# EAGLE design TimerShield (EAGLE 6.3)
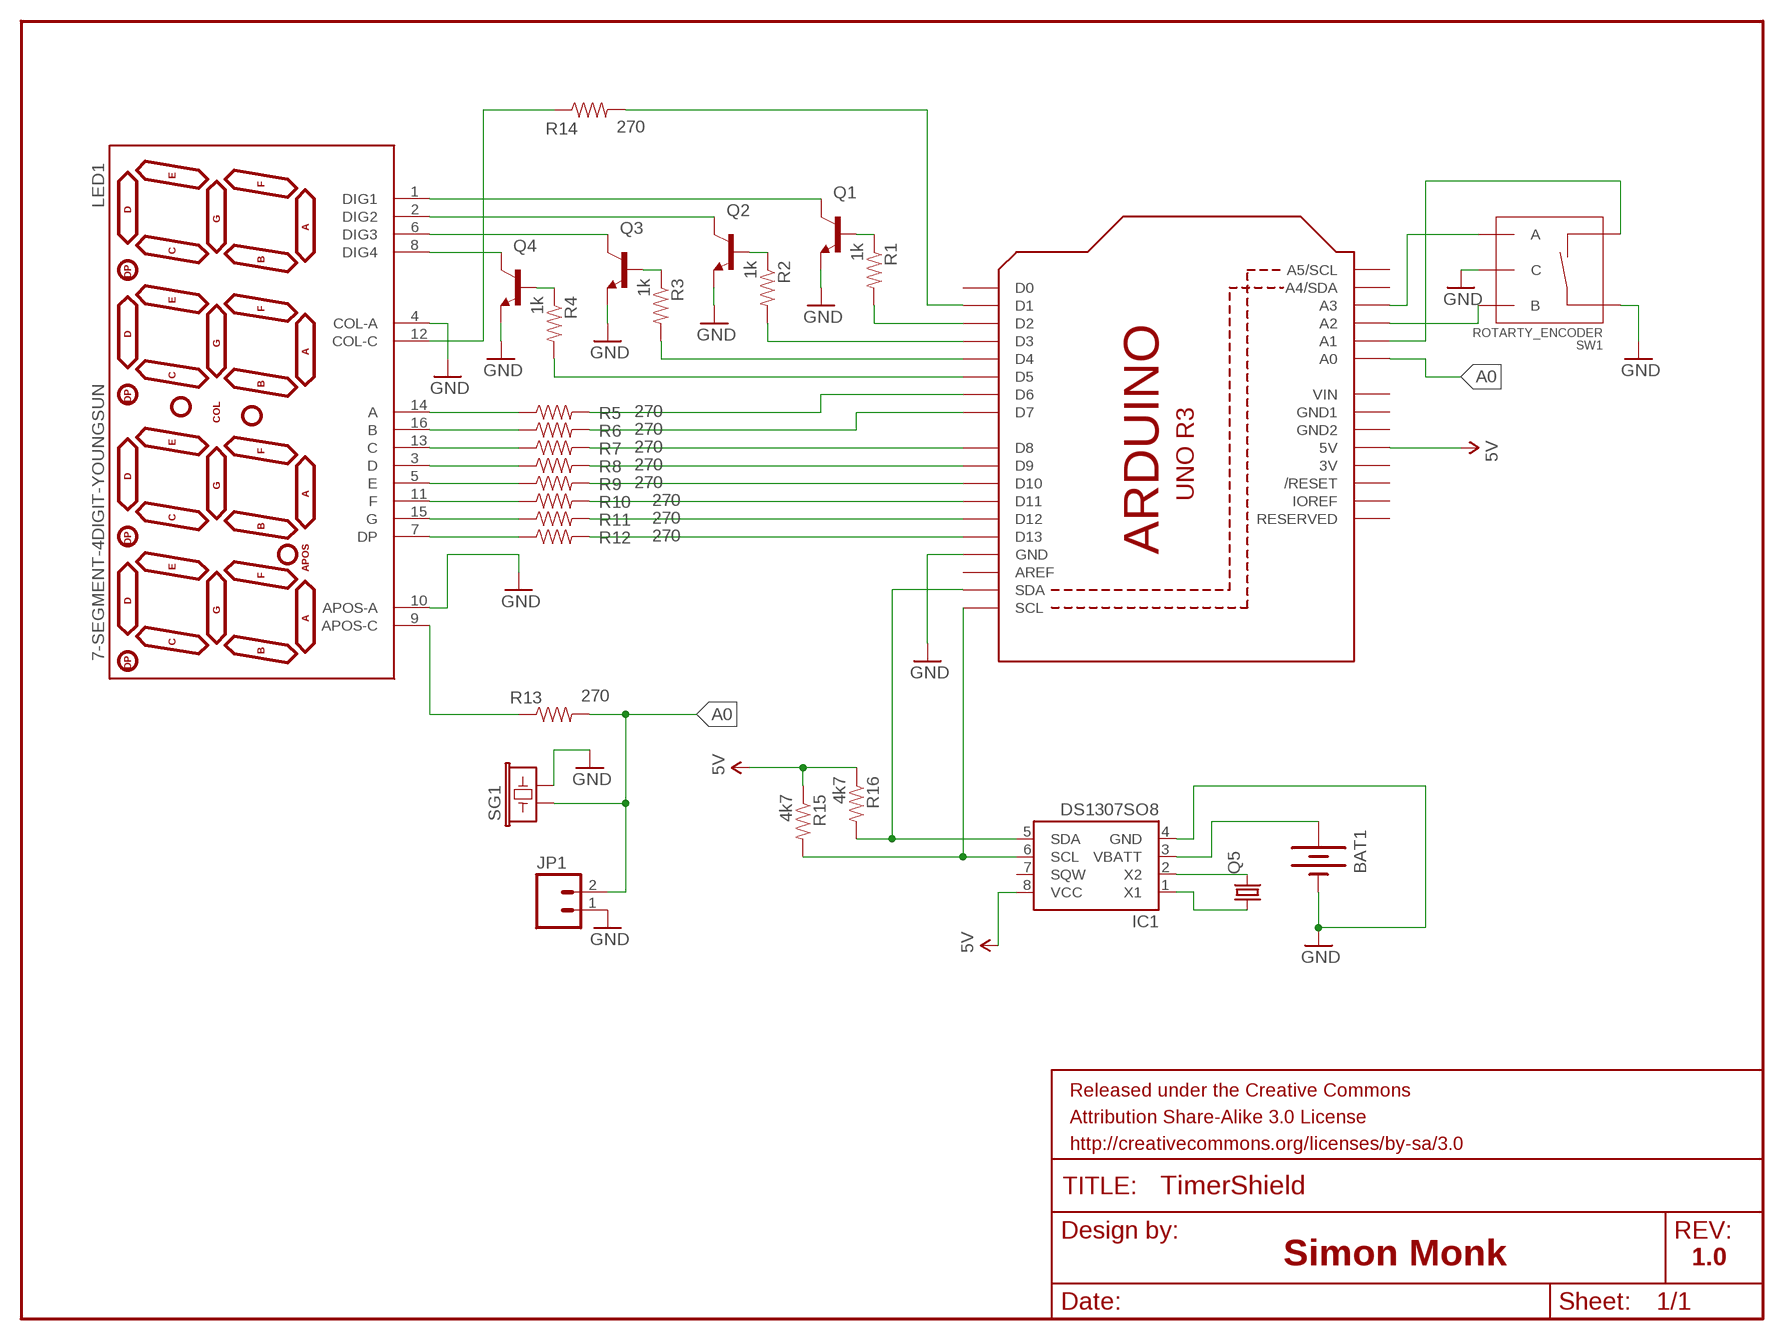
[diagram p0: schematic, sheet 1]

## Parts
BAT1  BATTERY12MM  [BATTCON_12MM]
FRAME1  FRAME-LETTER  [CREATIVE_COMMONS]
IC1  DS1307SO8  [SO08]
JP1  M023.5MM  [SCREWTERMINAL-3.5MM-2]
LED1  7-SEGMENT-4DIGIT-YOUNGSUN  [7-SEGMENT-4DIGIT-YOUNGSUN]
Q1  TRANSISTOR_NPNSOT23  [SOT23]
Q2  TRANSISTOR_NPNSOT23  [SOT23]
Q3  TRANSISTOR_NPNSOT23  [SOT23]
Q4  TRANSISTOR_NPNSOT23  [SOT23]
Q5  CRYSTALTC26H  [TC26H]
R1  1k  RESISTOR0805-RES  [0805]
R2  1k  RESISTOR0805-RES  [0805]
R3  1k  RESISTOR0805-RES  [0805]
R4  1k  RESISTOR0805-RES  [0805]
R5  270  RESISTOR0805-RES  [0805]
R6  270  RESISTOR0805-RES  [0805]
R7  270  RESISTOR0805-RES  [0805]
R8  270  RESISTOR0805-RES  [0805]
R9  270  RESISTOR0805-RES  [0805]
R10  270  RESISTOR0805-RES  [0805]
R11  270  RESISTOR0805-RES  [0805]
R12  270  RESISTOR0805-RES  [0805]
R13  270  RESISTOR0805-RES  [0805]
R14  270  RESISTOR0805-RES  [0805]
R15  4k7  RESISTOR0805-RES  [0805]
R16  4k7  RESISTOR0805-RES  [0805]
SG1  BUZZERNS  [BUZZER-12MM-NS]
SW1  ROTARTY_ENCODER  [ROTARY_ENC_PLAIN]
U1  ARDUINOR3-DIMENSION  [ARDUINOR3]

## Nets
5V: IC1.8(VCC) R15.1 R16.1 U1.5V
A0: JP1.2 R13.2 SG1.+ U1.A0
GND [power]: BAT1.GND(-) IC1.4(GND) JP1.1 LED1.4(COL-A) LED1.10(APOS-A) Q1.2(E) Q2.2(E) Q3.2(E) Q4.2(E) SG1.- SW1.C SW1.SW+ U1.GND
N$1 [power]: LED1.8(DIG4) Q4.3(C)
N$2 [power]: LED1.6(DIG3) Q3.3(C)
N$3 [power]: LED1.2(DIG2) Q2.3(C)
N$4 [power]: LED1.1(DIG1) Q1.3(C)
N$5: Q4.1(B) R4.1
N$6: Q3.1(B) R3.1
N$7: Q2.1(B) R2.1
N$8: Q1.1(B) R1.1
N$9: R1.2 U1.D2
N$10: R2.2 U1.D3
N$11: R3.2 U1.D4
N$12: R4.2 U1.D5
N$13: LED1.14(A) R5.1
N$14: LED1.16(B) R6.1
N$15: LED1.13(C) R7.1
N$16: LED1.3(D) R8.1
N$17: LED1.5(E) R9.1
N$18: LED1.11(F) R10.1
N$19: LED1.15(G) R11.1
N$20: LED1.7(DP) R12.1
N$21: R5.2 U1.D6
N$22: R6.2 U1.D7
N$23: R7.2 U1.D8
N$24: R8.2 U1.D9
N$25: R9.2 U1.D10
N$26: R10.2 U1.D11
N$27: R11.2 U1.D12
N$28: R12.2 U1.D13
N$29: LED1.12(COL-C) R14.1
N$31: SW1.A U1.A3
N$32: SW1.B U1.A2
N$33: R14.2 U1.D1
N$34: SW1.SW- U1.A1
N$35: IC1.2(X2) Q5.2
N$36: IC1.1(X1) Q5.1
N$37: IC1.6(SCL) R15.2 U1.SCL
N$38: IC1.5(SDA) R16.2 U1.SDA
N$39: LED1.9(APOS-C) R13.1
N$40: BAT1.PWR@1(+) IC1.3(VBATT)
Unconnected: IC1.7(SQW) U1.A4(A4/SDA) U1.A5(A5/SCL) U1.AREF U1.D0 U1.IOREF U1.RESERVED U1.RESET(/RESET)

## Notes on the sheet
- Simon Monk | 1.0

## Power pins joined to a net without a drawn wire
3V: U1.3V
GND1: U1.GND1
GND2: U1.GND2
VIN: U1.VIN

## Library data of the parts
BAT1 = SparkFun-Electromechanical:BATTERY: Battery Holders Various common sizes : AA, AAA, 20mm coin cell and 12mm coin cell. 20MM_4LEGS, BATT-10373
FRAME1 = SparkFun-Aesthetics:FRAME-LETTER: Schematic Frame Standard 8.5x11 US Letter frame
IC1 = SparkFun-FreqCtrl:DS1307: I2C real-time clock with battery backup.
JP1 = SparkFun-Connectors:M02: Header 2 Standard 2-pin 0.1" header. Use with straight break away headers (SKU : PRT-00116), right angle break away headers (PRT-00553), swiss pins (PRT-00743), machine pins (PRT-00117), and female headers (PRT-00115). Molex polarized connector foot print use with SKU : PRT-08233 with associated crimp pins and housings.
LED1 = SparkFun-Displays:7-SEGMENT-4DIGIT-YOUNGSUN: This is a part for the 4-Digit 7-segment LEDs from Young Sun. Different from the Digikey LEDs, all 16 pins are used. The LONGPADS Variant is used for a test jig, but you may like it because there is more pad to solder to. If you are concerned about routing space, the standard works just fine though.
Q1-Q4 = SparkFun-DiscreteSemi:TRANSISTOR_NPN: Generic NPN BJT. MMBT2222 is the common NPN we use. Double check against datasheet- not all devices are the same!
Q5 = adafruit:CRYSTAL: CRYSTAL; OC_FARNELL: unknown; OC_NEWARK: unknown
R1-R16 = SparkFun-Resistors:RESISTOR: Resistor Basic schematic elements and footprints for 0603, 1206, and PTH resistors.
SG1 = SparkFun-Electromechanical:BUZZER: Buzzer 12mm Spark Fun Electronics SKU : Comp-Buzzer
SW1 = SparkFun-Electromechanical:ROTARTY_ENCODER: Simple no LED rotary encoder Example: COM-09117
U1 = adafruit:ARDUINOR3: This is a new object for the new Arduino R3 - with extra pins that you may want to use (such as IOref, and duplicated A4/A5

## Net classes
0 default: width 0.305 mm
1 power: width 0.61 mm

## Board
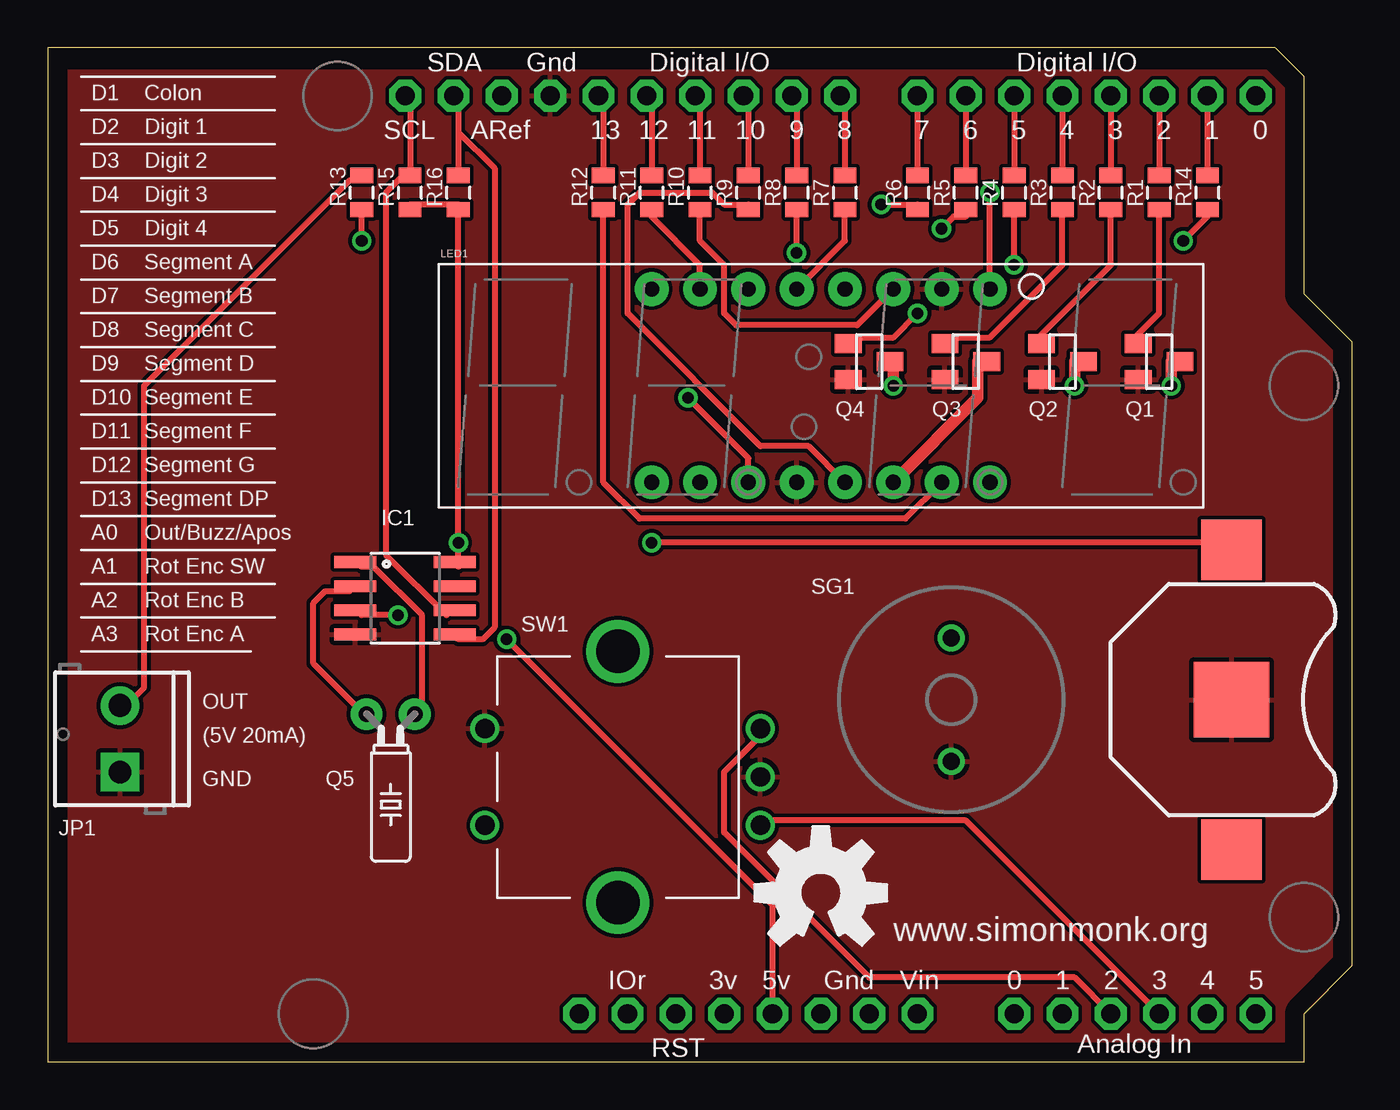
[diagram p1: board, top side]
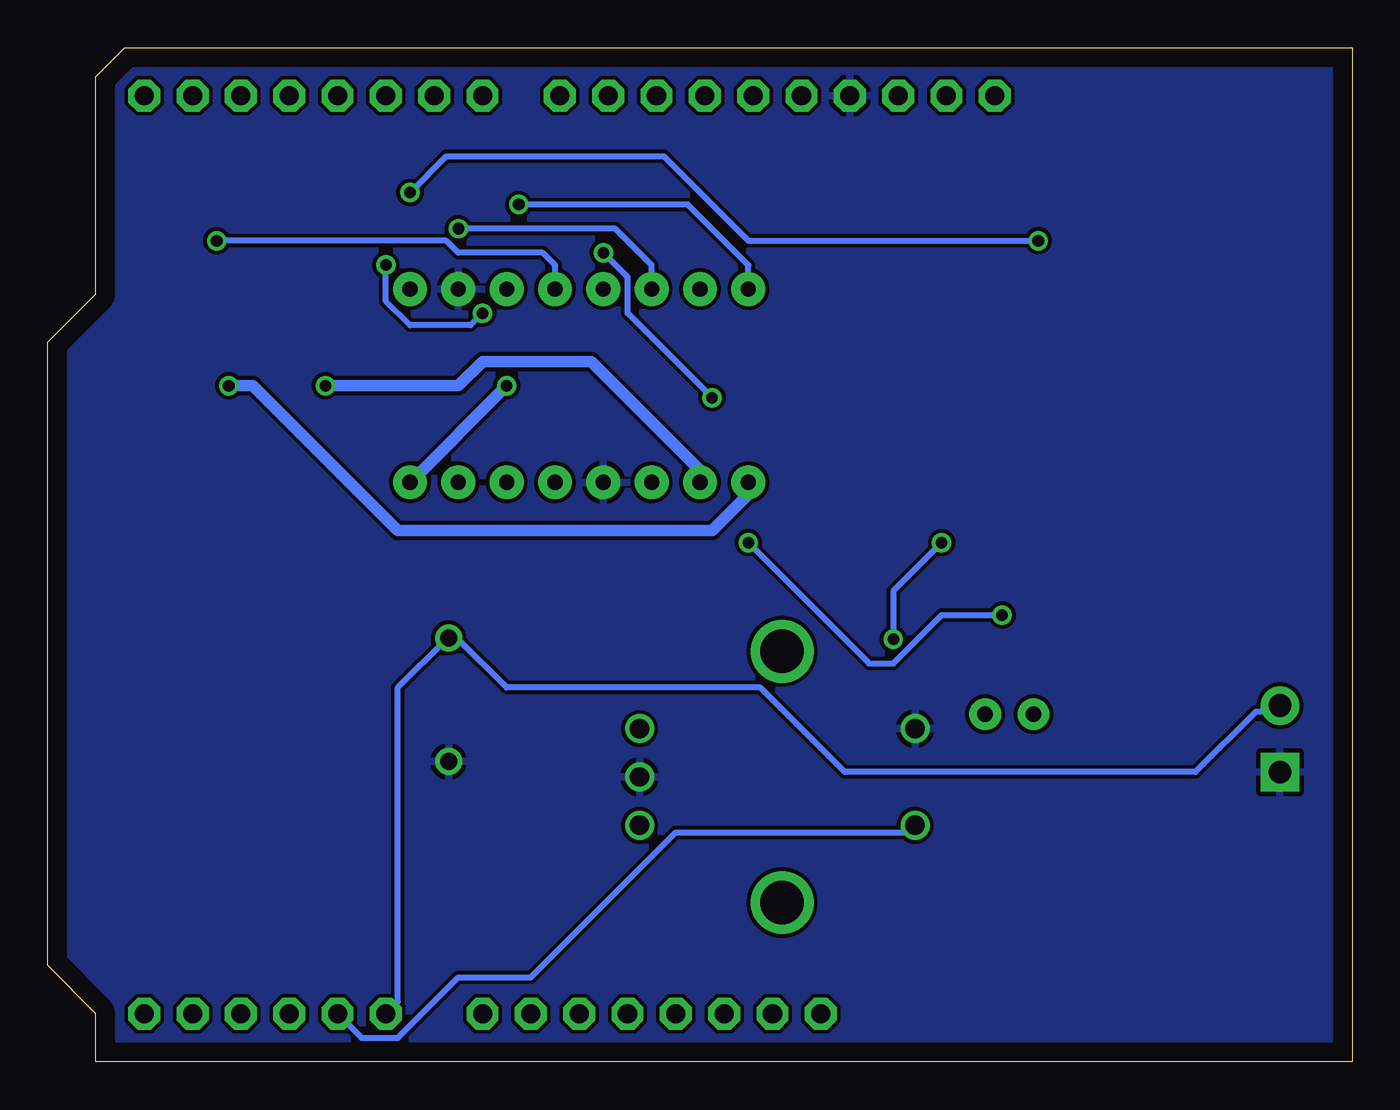
[diagram p2: board, bottom side, seen from below]

Size 68.58 x 53.34 mm. Coordinates in mm from the lower left corner, seen from the top.
Copper layers (1*16): Top 0.035mm / dielectric 1.5mm / Bottom 0.035mm
Design rules "default": minimum track width 10mil, minimum drill 24mil, track to track 8mil, track to pad 8mil, pad to pad 8mil, via to via 8mil, smd to smd 8mil, copper to edge 40mil, drill to drill 8mil, minimum pad ring 10mil, minimum via ring 8mil, stop-mask expansion 4mil, vias tented up to drill 0mil, thermal gap 10mil

### Footprints (pad centres in the part's own frame; a part is rotated, then mirrored left to right if it is on the bottom)
BATTCON_12MM = smd 3.962 x 3.962: GND 0,0 | smd 3.175 x 3.175: PWR@1 -7.874,0; PWR@2 7.874,0
SO08 = smd 0.61 x 2.21: 1 -1.905,-2.616; 2 -0.635,-2.616; 3 0.635,-2.616; 4 1.905,-2.616; 5 1.905,2.616; 6 0.635,2.616; 7 -0.635,2.616; 8 -1.905,2.616
SCREWTERMINAL-3.5MM-2 = drill 1.2 pad 2.032 square: 1 0,0 | drill 1.2 pad 2.032: 2 3.5,0
7-SEGMENT-4DIGIT-YOUNGSUN = drill 0.8 pad 1.778: 1 -8.89,-5.08; 2 -6.35,-5.08; 3 -3.81,-5.08; 4 -1.27,-5.08; 5 1.27,-5.08; 6 3.81,-5.08; 7 6.35,-5.08; 8 8.89,-5.08; 9 8.89,5.08; 10 6.35,5.08; 11 3.81,5.08; 12 1.27,5.08; 13 -1.27,5.08; 14 -3.81,5.08; 15 -6.35,5.08; 16 -8.89,5.08
SOT23 = smd 1 x 1.4: 1 -0.95,-1.1; 2 0.95,-1.1; 3 0,1.1
TC26H = drill 0.813 pad 1.676: 1 -1.27,0; 2 1.27,0
0805 = smd 0.8 x 1.2: 1 -0.9,0; 2 0.9,0
BUZZER-12MM-NS = drill 0.9: + 3.25,0; - -3.25,0
ROTARY_ENC_PLAIN = drill 1.016: A 7.493,-2.54; B 7.493,2.54; C 7.493,0; SW+ -6.985,2.54; SW- -6.985,-2.54 | drill 2.286: P$3 0,6.604; P$4 0,-6.604
ARDUINOR3 = drill 1 pad 1.676 octagon: 3V 35.56,2.54; 5V 38.1,2.54; A0 50.8,2.54; A1 53.34,2.54; A2 55.88,2.54; A3 58.42,2.54; A4 60.96,2.54; A5 63.5,2.54; AREF 23.876,50.8; D0 63.5,50.8; D1 60.96,50.8; D2 58.42,50.8; D3 55.88,50.8; D4 53.34,50.8; D5 50.8,50.8; D6 48.26,50.8; D7 45.72,50.8; D8 41.656,50.8; D9 39.116,50.8; D10 36.576,50.8; D11 34.036,50.8; D12 31.496,50.8; D13 28.956,50.8; GND 26.416,50.8; GND1 43.18,2.54; GND2 40.64,2.54; IOREF 30.48,2.54; RESERVED 27.94,2.54; RESET 33.02,2.54; SCL 18.796,50.8; SDA 21.336,50.8; VIN 45.72,2.54

### Placement (x,y rotation side)
BAT1  62.23,19.05 270 top
FRAME1  2.54,-15.24 0 top  (outside the outline)
IC1  18.8,24.38 270 top
JP1  3.81,15.24 90 top
LED1  40.64,35.56 0 top
Q1  58.42,36.83 270 top
Q2  53.34,36.83 270 top
Q3  48.26,36.83 270 top
Q4  43.18,36.83 270 top
Q5  18.03,18.29 180 top
R1  58.42,45.72 90 top
R2  55.88,45.72 90 top
R3  53.34,45.72 90 top
R4  50.8,45.72 90 top
R5  48.26,45.72 90 top
R6  45.72,45.72 90 top
R7  41.91,45.72 90 top
R8  39.37,45.72 90 top
R9  36.83,45.72 90 top
R10  34.29,45.72 90 top
R11  31.75,45.72 90 top
R12  29.21,45.72 90 top
R13  16.51,45.72 90 top
R14  60.96,45.72 90 top
R15  19.05,45.72 90 top
R16  21.59,45.72 90 top
SG1  47.5,19.05 90 top
SW1  29.97,14.99 0 top
U1  0,0 0 top
U$1  [OSHW-LOGO-L]  40.64,8.89 0 top

### Tracks (layer width: path | path; a pad name or v marks a point on that pad's centre or on a via)
5V  (via drill 0.61)
  Top 0.305: R15.1 19.05,45.09 21.59,45.09 R16.1 v21.59,27.3 21.59,26.04 IC1.8 | U1.5V 38.1,8.26 v24.13,22.23
  Bottom 0.305: v24.13,22.23 24.13,24.77 v21.59,27.3
A0
  Top 0.305: R13.2 16.51,46.35 15.88,46.35 5.08,35.56 5.08,19.68 3.81,18.41 JP1.2
  Bottom 0.305: U1.A0 50.16,3.17 50.16,19.68 47.62,22.23 SG1.+ 46.99,22.23 44.45,19.68 31.11,19.68 26.67,15.24 8.26,15.24 5.08,18.41 3.81,18.41 JP1.2
GND
  pour Bottom: 0,0 0,53.34 64.77,53.34 66.04,52.07 66.04,40.64 68.58,38.1 68.58,5.08 66.04,2.54 66.04,0
  pour Top: 1.27,52.07 64.01,52.07 65.02,51.05 65.02,40.39 65.28,40.13 67.82,37.59 67.82,5.33 65.28,2.79 65.28,0.76 1.02,0.76 0.76,1.02 0.76,52.07
N$1  (via drill 0.61)
  Top 0.61: v44.45,35.56 44.45,36.83 Q4.3
  Bottom 0.61: LED1.8 v44.45,35.56
N$2
  Top 0.61: LED1.6 48.9,34.92 48.9,36.83 Q3.3
N$3  (via drill 0.61)
  Top 0.61: v53.98,35.56 53.98,36.83 Q2.3
  Bottom 0.61: v53.98,35.56 46.99,35.56 45.72,36.83 40.01,36.83 34.29,31.11 LED1.2
N$4  (via drill 0.61)
  Top 0.61: v59.05,35.56 59.05,36.83 Q1.3
  Bottom 0.61: v59.05,35.56 57.78,35.56 50.16,27.94 33.66,27.94 31.75,29.84 LED1.1
N$5  (via drill 0.61)
  Top 0.305: v50.8,41.91 R4.1 | v45.72,39.37 44.45,38.1 42.55,38.1 Q4.1
  Bottom 0.305: v50.8,41.91 50.8,40.01 49.53,38.73 46.35,38.73 v45.72,39.37
N$6
  Top 0.305: R3.1 53.34,41.91 49.53,38.1 47.62,38.1 Q3.1
N$7
  Top 0.305: R2.1 55.88,41.91 52.07,38.1 Q2.1
N$8
  Top 0.305: R1.1 58.42,39.37 57.15,38.1 Q1.1
N$9
  Top 0.305: U1.D2 R1.2
N$10
  Top 0.305: U1.D3 R2.2
N$11
  Top 0.305: U1.D4 R3.2
N$12
  Top 0.305: U1.D5 R4.2
N$13  (via drill 0.61)
  Top 0.305: v46.99,43.81 47.62,44.45 48.26,44.45 R5.1
  Bottom 0.305: v46.99,43.81 38.73,43.81 36.83,41.91 LED1.14
N$14  (via drill 0.61)
  Top 0.305: v43.81,45.09 45.72,45.09 R6.1
  Bottom 0.305: v43.81,45.09 34.92,45.09 31.75,41.91 LED1.16
N$15
  Top 0.305: R7.1 41.91,43.18 LED1.13
N$16  (via drill 0.61)
  Top 0.305: v39.37,42.55 R8.1 | v33.66,34.92 36.83,31.75 LED1.3
  Bottom 0.305: v39.37,42.55 38.1,41.27 38.1,39.37 v33.66,34.92
N$17
  Top 0.305: LED1.5 40.01,32.38 37.47,32.38 30.48,39.37 30.48,45.09 31.11,45.72 34.92,45.72 35.56,45.09 36.83,45.09 R9.1
N$18
  Top 0.305: R10.1 34.29,43.18 35.56,41.91 35.56,39.37 36.2,38.73 42.55,38.73 LED1.11
N$19
  Top 0.305: LED1.15 34.29,41.91 31.75,44.45 R11.1
N$20
  Top 0.305: R12.1 29.21,30.48 31.11,28.57 45.09,28.57 LED1.7
N$21
  Top 0.305: U1.D6 R5.2
N$22
  Top 0.305: U1.D7 R6.2
N$23
  Top 0.305: R7.2 41.91,50.8 U1.D8
N$24
  Top 0.305: R8.2 39.37,50.8 U1.D9
N$25
  Top 0.305: R9.2 36.83,50.8 U1.D10
N$26
  Top 0.305: R10.2 34.29,50.8 U1.D11
N$27
  Top 0.305: R11.2 31.75,50.8 U1.D12
N$28
  Top 0.305: R12.2 29.21,50.8 U1.D13
N$29  (via drill 0.61)
  Top 0.305: v59.69,43.18 60.96,44.45 R14.1
  Bottom 0.305: v59.69,43.18 47.62,43.18 46.99,42.55 42.55,42.55 41.91,41.91 LED1.12
N$31
  Top 0.305: U1.A3 48.26,12.7 37.47,12.7 SW1.A
N$32
  Top 0.305: U1.A2 53.98,4.45 43.18,4.45 35.56,12.06 35.56,15.24 37.47,17.14 SW1.B
N$33
  Top 0.305: U1.D1 R14.2
N$34
  Bottom 0.305: U1.A1 52.07,1.27 50.16,1.27 46.99,4.45 43.18,4.45 35.56,12.06 23.5,12.06 SW1.SW-
N$35
  Top 0.305: IC1.2 15.88,24.77 14.61,24.77 13.97,24.13 13.97,20.95 16.51,18.41 Q5.2
N$36
  Top 0.305: IC1.1 16.51,26.04 17.14,26.04 19.68,23.5 19.68,18.41 Q5.1
N$37
  Top 0.305: 19.05,46.99 19.05,50.8 U1.SCL | 19.05,46.99 17.78,45.72 17.78,26.67 20.95,23.5 IC1.6 | 19.05,46.99 R15.2
N$38
  Top 0.305: 21.59,48.9 21.59,50.8 U1.SDA | 21.59,48.9 R16.2 | 21.59,48.9 23.5,46.99 23.5,22.86 22.86,22.23 21.59,22.23 IC1.5
N$39  (via drill 0.61)
  Top 0.305: v16.51,43.18 R13.1 | LED1.9 v49.53,45.72
  Bottom 0.305: v16.51,43.18 31.75,43.18 36.2,47.62 47.62,47.62 v49.53,45.72
N$40  (via drill 0.61)
  Top 0.305: v18.41,23.5 16.51,23.5 IC1.3 | v31.75,27.3 62.23,27.3 BAT1.PWR@1
  Bottom 0.305: v18.41,23.5 21.59,23.5 24.13,20.95 25.4,20.95 v31.75,27.3

### Text on the board
tPlace: D1 | Colon | D2 | Digit 1 | D3 | Digit 2 | D4 | Digit 3 | D5 | Digit 4 | D6 | Segment A | D7 | Segment B | D8 | Segment C | D9 | Segment D | D10 | Segment E | D11 | Segment F | D12 | Segment G | D13 | Segment DP | A0 | Out/Buzz/Apos | A1 | Rot Enc SW | A2 | Rot Enc B | A3 | Rot Enc A | OUT | (5V 20mA) | GND | www.simonmonk.org